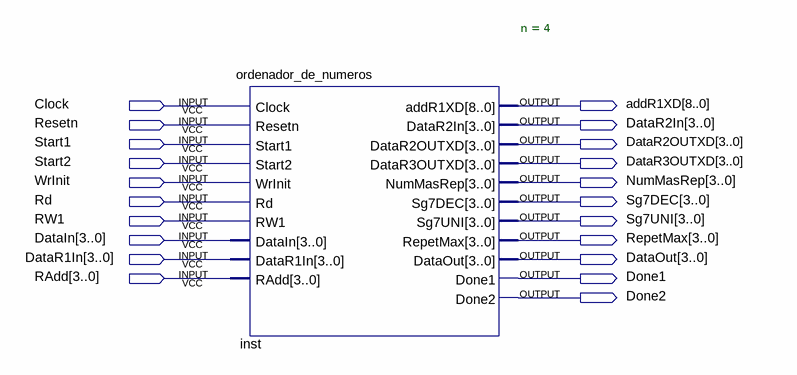
[diagram p0: schematic sheet]
// Quartus schematic ORDENADOR.bdf as structural Verilog: 1 symbols, 21 pins
module ORDENADOR (
  input  Clock,
  input  Resetn,
  input  Start1,
  input  Start2,
  input  WrInit,
  input  Rd,
  input  RW1,
  input  [3:0] DataIn,
  input  [3:0] DataR1In,
  input  [3:0] RAdd,
  output [8:0] addR1XD,
  output [3:0] DataR2In,
  output [3:0] DataR2OUTXD,
  output [3:0] DataR3OUTXD,
  output [3:0] NumMasRep,
  output [3:0] Sg7DEC,
  output [3:0] Sg7UNI,
  output [3:0] RepetMax,
  output [3:0] DataOut,
  output Done1,
  output Done2
);

  ordenador_de_numeros #(.n(4)) inst (
    .Clock(Clock), .Resetn(Resetn), .Start1(Start1), .Start2(Start2), .WrInit(WrInit), .Rd(Rd), .RW1(RW1),
    .DataIn(DataIn), .DataR1In(DataR1In), .RAdd(RAdd), .addR1XD(addR1XD), .DataR2In(DataR2In),
    .DataR2OUTXD(DataR2OUTXD), .DataR3OUTXD(DataR3OUTXD), .NumMasRep(NumMasRep), .Sg7DEC(Sg7DEC),
    .Sg7UNI(Sg7UNI), .RepetMax(RepetMax), .DataOut(DataOut), .Done1(Done1), .Done2(Done2));
endmodule
